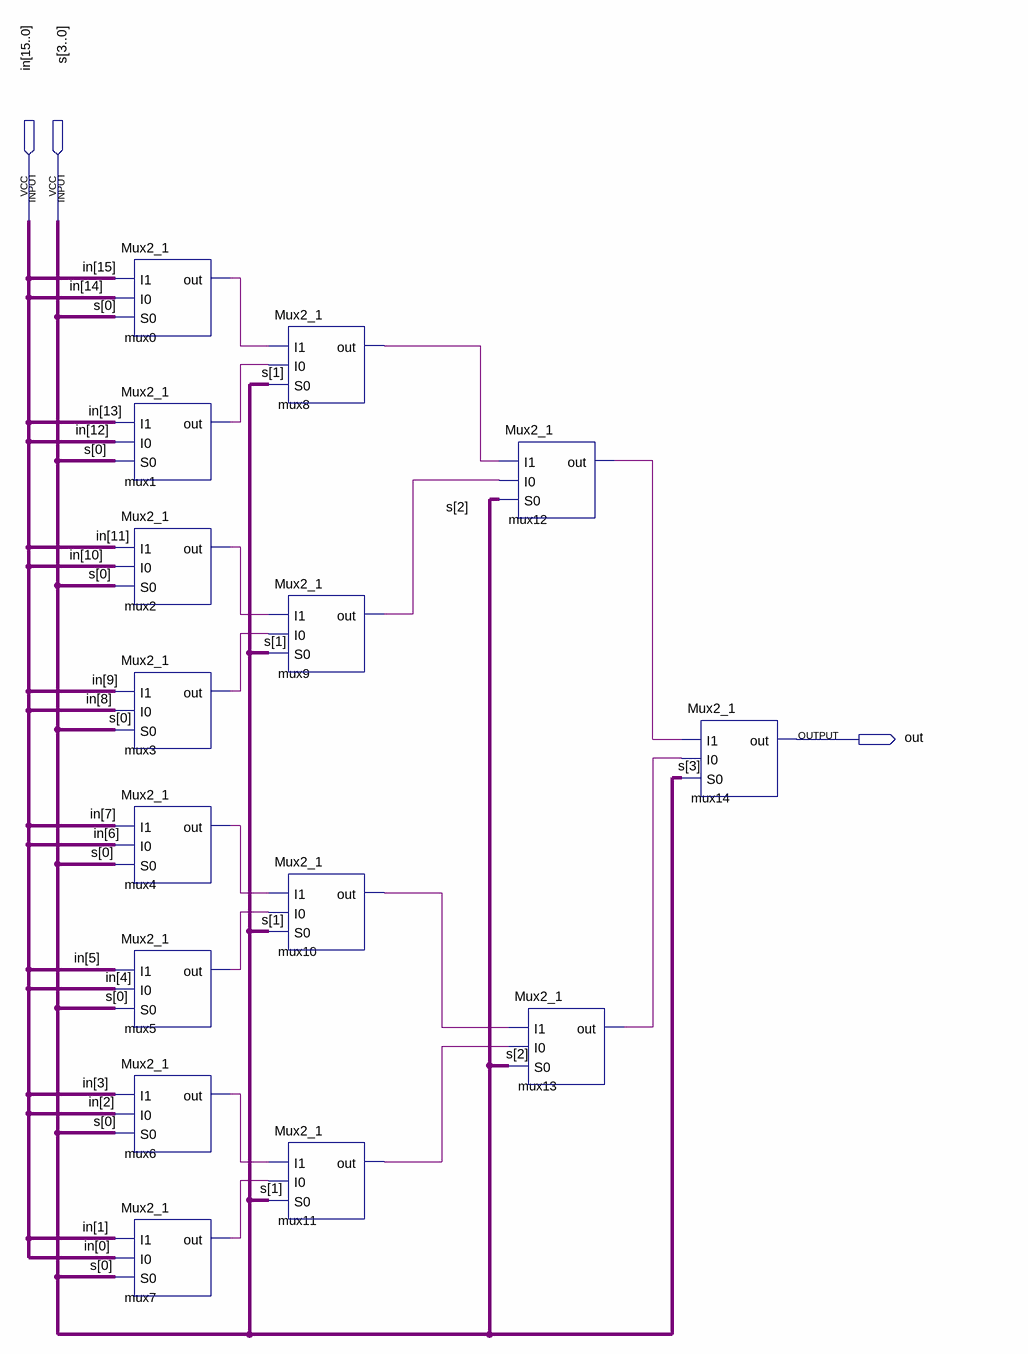
[diagram p0: schematic sheet]
// Quartus schematic Mux16_1.bdf as structural Verilog: 15 symbols, 3 pins
module Mux16_1 (
  input  [15:0] in,
  input  [3:0] s,
  output out
);

  wire mux0_out, mux1_out, mux2_out, mux3_out, mux4_out, mux5_out, mux6_out, mux7_out, mux8_out, mux9_out,
       mux10_out, mux11_out, mux12_out, mux13_out;

  Mux2_1 mux0 (.I1(in[15]), .I0(in[14]), .S0(s[0]), .out(mux0_out));
  Mux2_1 mux1 (.I1(in[13]), .I0(in[12]), .S0(s[0]), .out(mux1_out));
  Mux2_1 mux2 (.I1(in[11]), .I0(in[10]), .S0(s[0]), .out(mux2_out));
  Mux2_1 mux3 (.I1(in[9]), .I0(in[8]), .S0(s[0]), .out(mux3_out));
  Mux2_1 mux4 (.I1(in[7]), .I0(in[6]), .S0(s[0]), .out(mux4_out));
  Mux2_1 mux5 (.I1(in[5]), .I0(in[4]), .S0(s[0]), .out(mux5_out));
  Mux2_1 mux6 (.I1(in[3]), .I0(in[2]), .S0(s[0]), .out(mux6_out));
  Mux2_1 mux7 (.I1(in[1]), .I0(in[0]), .S0(s[0]), .out(mux7_out));
  Mux2_1 mux8 (.I1(mux0_out), .I0(mux1_out), .S0(s[1]), .out(mux8_out));
  Mux2_1 mux9 (.I1(mux2_out), .I0(mux3_out), .S0(s[1]), .out(mux9_out));
  Mux2_1 mux10 (.I1(mux4_out), .I0(mux5_out), .S0(s[1]), .out(mux10_out));
  Mux2_1 mux11 (.I1(mux6_out), .I0(mux7_out), .S0(s[1]), .out(mux11_out));
  Mux2_1 mux12 (.I1(mux8_out), .I0(mux9_out), .S0(s[2]), .out(mux12_out));
  Mux2_1 mux13 (.I1(mux10_out), .I0(mux11_out), .S0(s[2]), .out(mux13_out));
  Mux2_1 mux14 (.I1(mux12_out), .I0(mux13_out), .S0(s[3]), .out(out));
endmodule
